# EAGLE schematic main (EAGLE 7.2.0)
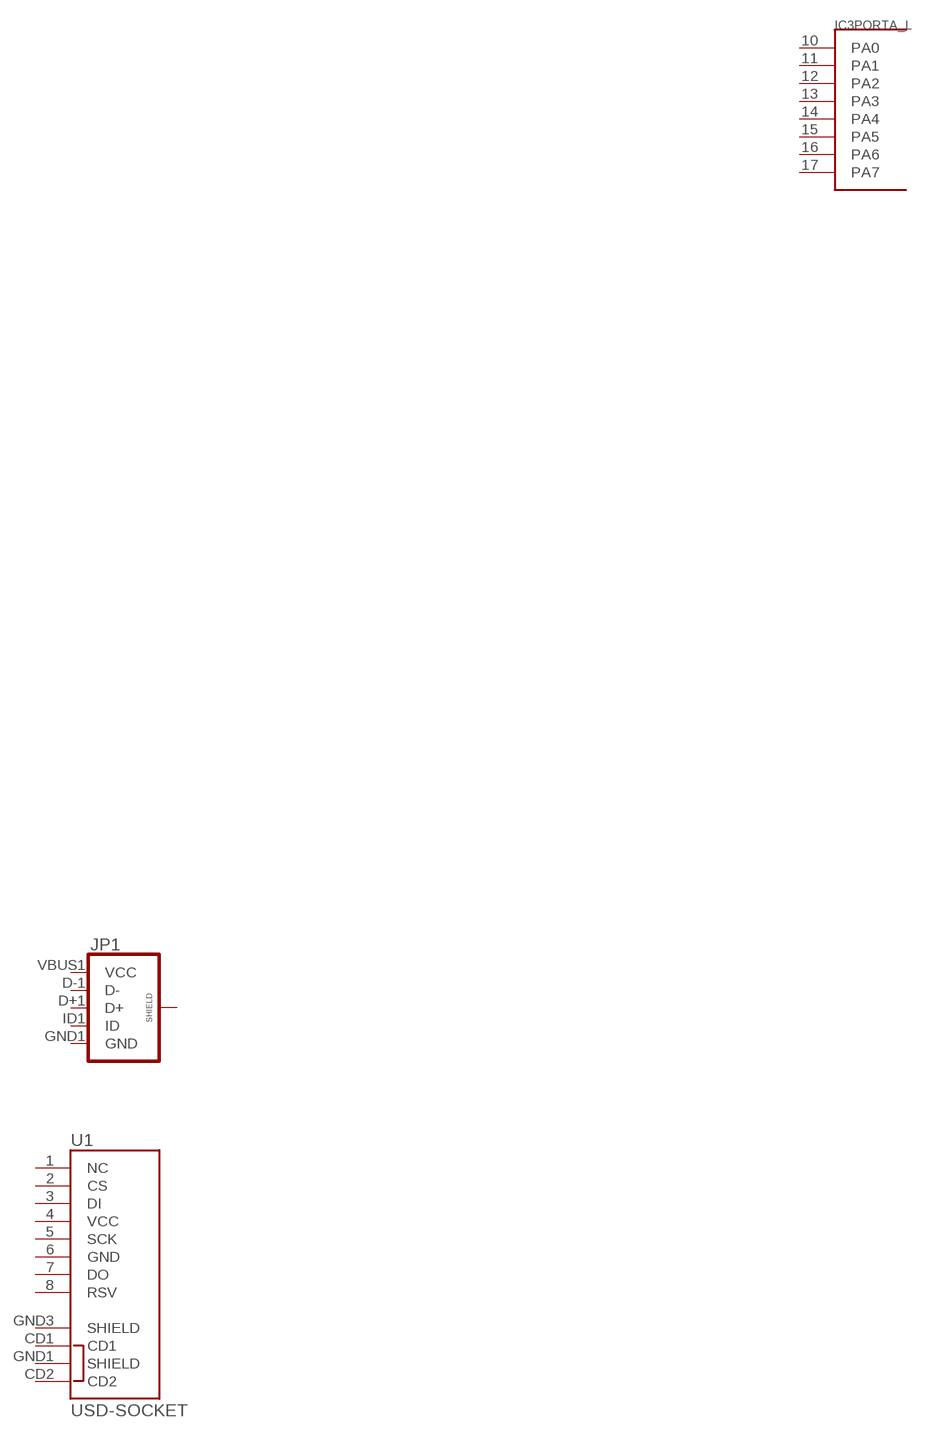
[diagram p0: schematic, sheet 1]

## Parts
IC3  STM32F10XCXT6  [TQFP48]
JP1  USB_MICROB_PLUGCONN-11752  [USB-B-MICRO-SMD_V03]
U1  USD-SOCKET  [MICROSD_1:1]
Unconnected: IC3.2(PORTC:PC13) IC3.3(PORTC:PC14) IC3.4(PORTC:PC15) IC3.5(PORTD/OSC:PD0/OSC<=) IC3.6(PORTD/OSC:PD1/OSC=>) IC3.7(RESET:NRST) IC3.10(PORTA_L:PA0) IC3.11(PORTA_L:PA1) IC3.12(PORTA_L:PA2) IC3.13(PORTA_L:PA3) IC3.14(PORTA_L:PA4) IC3.15(PORTA_L:PA5) IC3.16(PORTA_L:PA6) IC3.17(PORTA_L:PA7) IC3.18(PORTB_L:PB0) IC3.19(PORTB_L:PB1) IC3.20(PORTB_L:PB2) IC3.21(PORTB_H:PB10) IC3.22(PORTB_H:PB11) IC3.25(PORTB_H:PB12) IC3.26(PORTB_H:PB13) IC3.27(PORTB_H:PB14) IC3.28(PORTB_H:PB15) IC3.29(PORTA_H:PA8) IC3.30(PORTA_H:PA9) IC3.31(PORTA_H:PA10) IC3.32(PORTA_H:PA11) IC3.33(PORTA_H:PA12) IC3.34(PORTA_H:PA13) IC3.37(PORTA_H:PA14) IC3.38(PORTA_H:PA15) IC3.39(PORTB_L:PB3) IC3.40(PORTB_L:PB4) IC3.41(PORTB_L:PB5) IC3.42(PORTB_L:PB6) IC3.43(PORTB_L:PB7) IC3.44(RESET:BOOT0) IC3.45(PORTB_H:PB8) IC3.46(PORTB_H:PB9) JP1.D+1(D+) JP1.D-1(D-) JP1.GND1(GND) JP1.ID1(ID) JP1.SHIELD1(SHIELD) JP1.SHIELD2(SHIELD) JP1.SHIELD3(SHIELD) JP1.VBUS1(VCC) U1.1(NC) U1.2(CS) U1.3(DI) U1.4(VCC) U1.5(SCK) U1.6(GND) U1.7(DO) U1.8(RSV) U1.CD1 U1.CD2 U1.GND1(SHIELD) U1.GND3(SHIELD)

## Power pins joined to a net without a drawn wire
VBAT: IC3.1(AN_POWER:VBAT)
VDD_1: IC3.24(POWER:VDD_1)
VDD_2: IC3.36(POWER:VDD_2)
VDD_3: IC3.48(POWER:VDD_3)
VDDA: IC3.9(AN_POWER:VDDA)
VSS_1: IC3.23(POWER:VSS_1)
VSS_2: IC3.35(POWER:VSS_2)
VSS_3: IC3.47(POWER:VSS_3)
VSSA: IC3.8(AN_POWER:VSSA)

## Library data of the parts
IC3 = stm32:STM32F10XCXT6: ST STM32F101/103 48pin LQFP
JP1 = SparkFun-Connectors:USB_MICROB_PLUG: USB Micro-B connectors Some male, some female. Watch your step!; PROD_ID: CONN-11752
U1 = SparkFun-Connectors:USD-SOCKET: microSD Socket Push-push type uSD socket. Schematic element and footprint production proven. Spark Fun Electronics SKU : PRT-00127. tDoc lines correctly indicate media card edge positions when inserting (unlocked, locked, depressed). NOTE: CD1 and CD2 are connected internally; PROD_ID: CONN-07820